# Altium schematic sheet pga_zif.SchDoc
size 482 x 304 mm; SheetNumber: 7; SheetTotal: 13
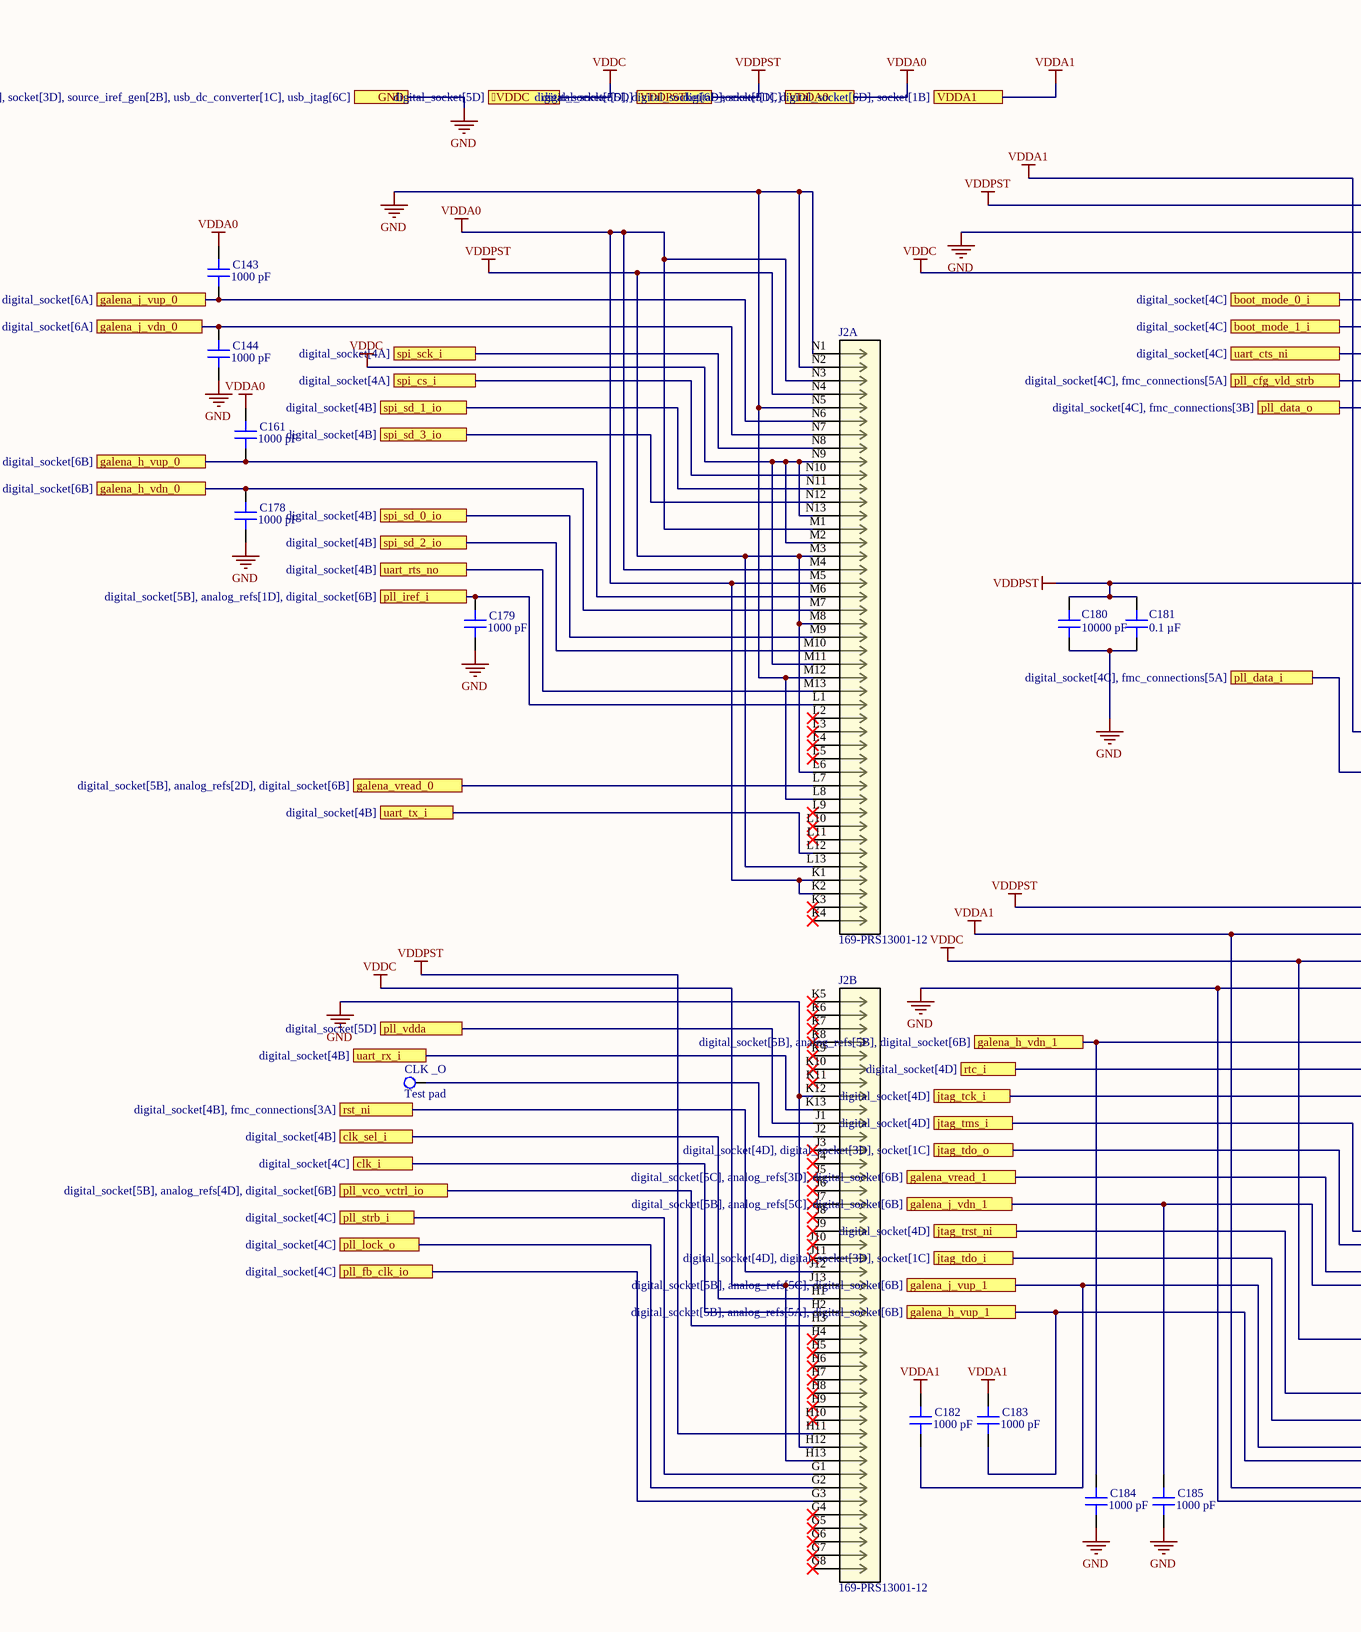
[diagram p0: pga_zif.SchDoc, left]
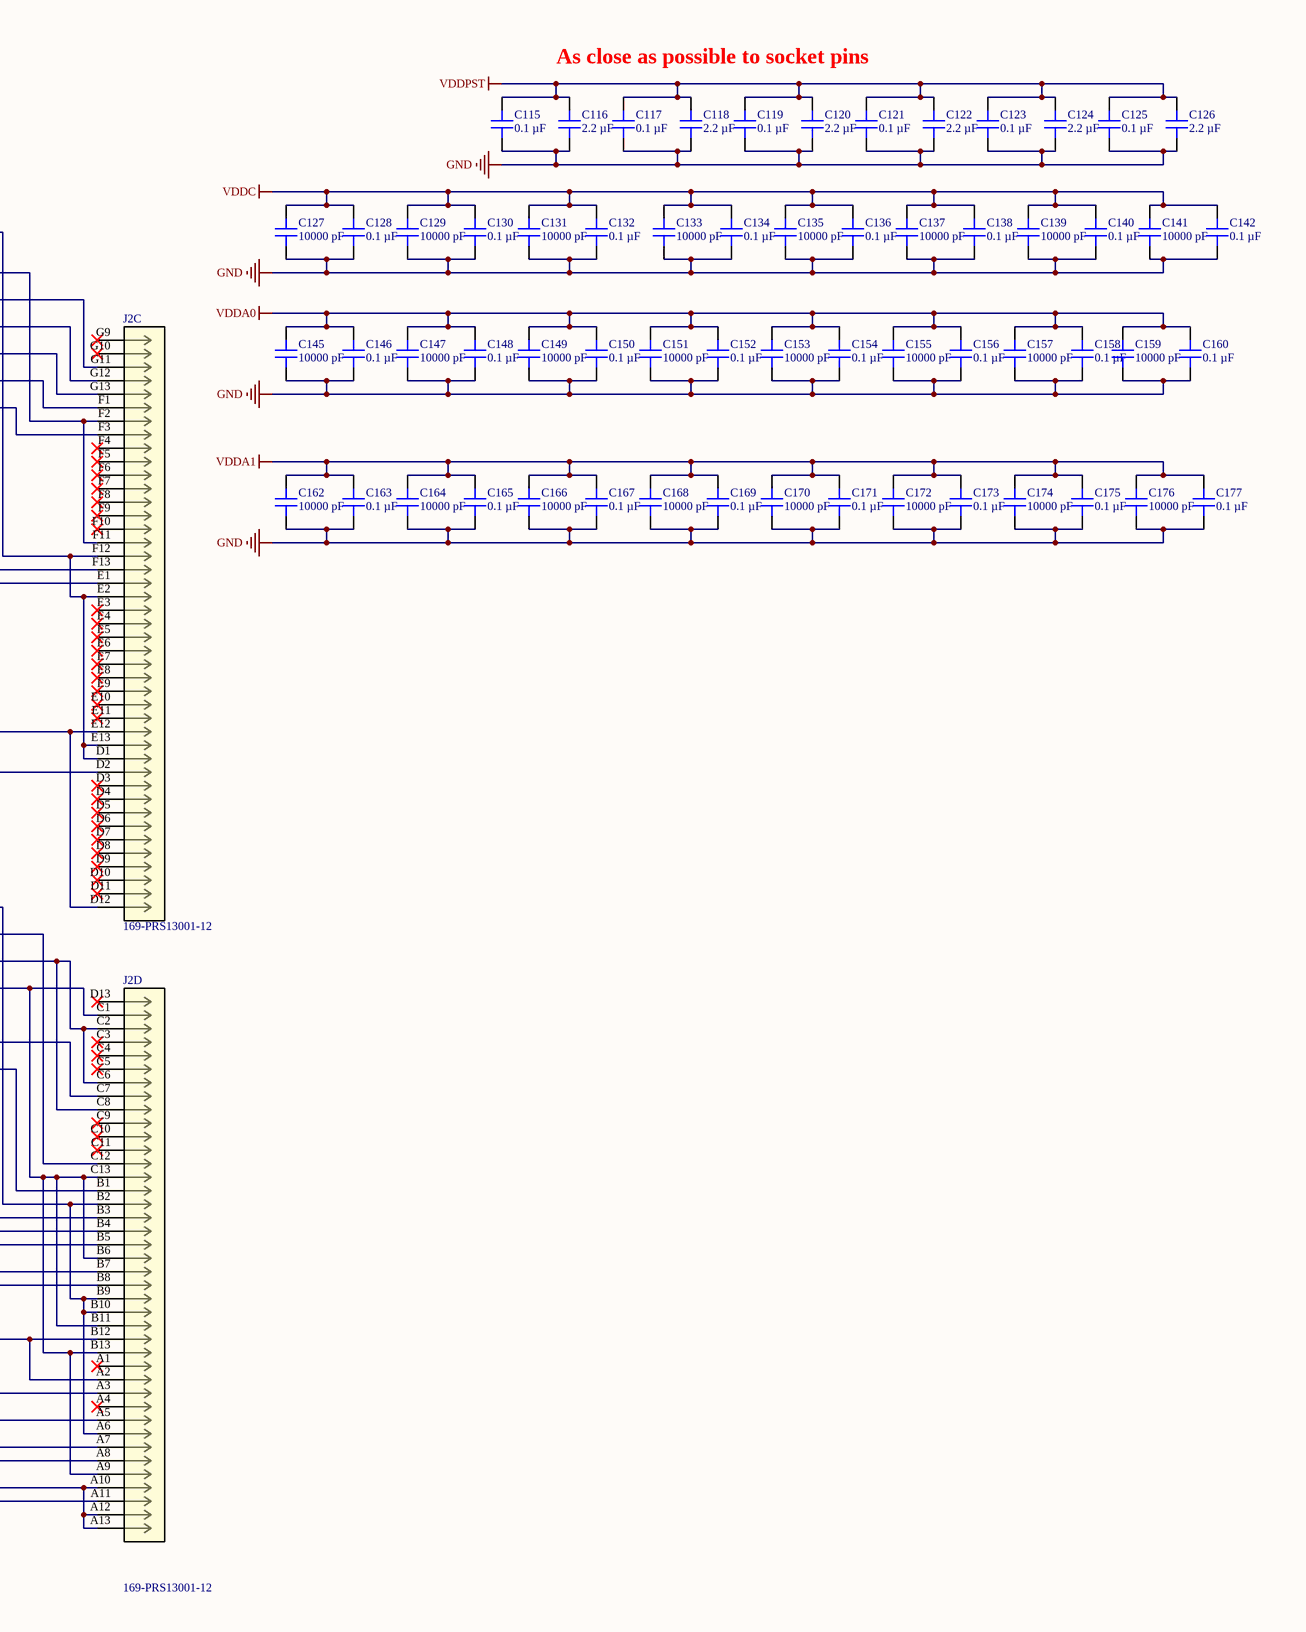
[diagram p1: pga_zif.SchDoc, right]

## Parts
C115  0.1 µF  [CAP 0805_2012]
C116  2.2 µF  [CAP 0805_2012]
C117  0.1 µF  [CAP 0805_2012]
C118  2.2 µF  [CAP 0805_2012]
C119  0.1 µF  [CAP 0805_2012]
C120  2.2 µF  [CAP 0805_2012]
C121  0.1 µF  [CAP 0805_2012]
C122  2.2 µF  [CAP 0805_2012]
C123  0.1 µF  [CAP 0805_2012]
C124  2.2 µF  [CAP 0805_2012]
C125  0.1 µF  [CAP 0805_2012]
C126  2.2 µF  [CAP 0805_2012]
C127  10000 pF  [CAP 0805_2012]
C128  0.1 µF  [CAP 0805_2012]
C129  10000 pF  [CAP 0805_2012]
C130  0.1 µF  [CAP 0805_2012]
C131  10000 pF  [CAP 0805_2012]
C132  0.1 µF  [CAP 0805_2012]
C133  10000 pF  [CAP 0805_2012]
C134  0.1 µF  [CAP 0805_2012]
C135  10000 pF  [CAP 0805_2012]
C136  0.1 µF  [CAP 0805_2012]
C137  10000 pF  [CAP 0805_2012]
C138  0.1 µF  [CAP 0805_2012]
C139  10000 pF  [CAP 0805_2012]
C140  0.1 µF  [CAP 0805_2012]
C141  10000 pF  [CAP 0805_2012]
C142  0.1 µF  [CAP 0805_2012]
C143  1000 pF  [CAP 0805_2012]
C144  1000 pF  [CAP 0805_2012]
C145  10000 pF  [CAP 0805_2012]
C146  0.1 µF  [CAP 0805_2012]
C147  10000 pF  [CAP 0805_2012]
C148  0.1 µF  [CAP 0805_2012]
C149  10000 pF  [CAP 0805_2012]
C150  0.1 µF  [CAP 0805_2012]
C151  10000 pF  [CAP 0805_2012]
C152  0.1 µF  [CAP 0805_2012]
C153  10000 pF  [CAP 0805_2012]
C154  0.1 µF  [CAP 0805_2012]
C155  10000 pF  [CAP 0805_2012]
C156  0.1 µF  [CAP 0805_2012]
C157  10000 pF  [CAP 0805_2012]
C158  0.1 µF  [CAP 0805_2012]
C159  10000 pF  [CAP 0805_2012]
C160  0.1 µF  [CAP 0805_2012]
C161  1000 pF  [CAP 0805_2012]
C162  10000 pF  [CAP 0805_2012]
C163  0.1 µF  [CAP 0805_2012]
C164  10000 pF  [CAP 0805_2012]
C165  0.1 µF  [CAP 0805_2012]
C166  10000 pF  [CAP 0805_2012]
C167  0.1 µF  [CAP 0805_2012]
C168  10000 pF  [CAP 0805_2012]
C169  0.1 µF  [CAP 0805_2012]
C170  10000 pF  [CAP 0805_2012]
C171  0.1 µF  [CAP 0805_2012]
C172  10000 pF  [CAP 0805_2012]
C173  0.1 µF  [CAP 0805_2012]
C174  10000 pF  [CAP 0805_2012]
C175  0.1 µF  [CAP 0805_2012]
C176  10000 pF  [CAP 0805_2012]
C177  0.1 µF  [CAP 0805_2012]
C178  1000 pF  [CAP 0805_2012]
C179  1000 pF  [CAP 0805_2012]
C180  10000 pF  [CAP 0805_2012]
C181  0.1 µF  [CAP 0805_2012]
C182  1000 pF  [CAP 0805_2012]
C183  1000 pF  [CAP 0805_2012]
C184  1000 pF  [CAP 0805_2012]
C185  1000 pF  [CAP 0805_2012]
CLK__O  Test pad  [Test Pad]
J2  169-PRS13001-12  [CONN_169-PRS13001-12_ARS]  (parts A,B,C,D of 4)

## Ports
VDDC (see digital_socket[5D]), boot_mode_0_i (see digital_socket[4C]), boot_mode_1_i (see digital_socket[4C]), clk_i (see digital_socket[4C]), clk_sel_i (see digital_socket[4B]), galena_h_vdn_0 (see digital_socket[5B], analog_refs[3C], digital_socket[6B]), galena_h_vdn_1 (see digital_socket[5B], analog_refs[5B], digital_socket[6B]), galena_h_vup_0 (see digital_socket[5B], analog_refs[3C], digital_socket[6B]), galena_h_vup_1 (see digital_socket[5B], analog_refs[5A], digital_socket[6B]), galena_j_vdn_0 (see digital_socket[5A], analog_refs[2C], digital_socket[6A]), galena_j_vdn_1 (see digital_socket[5B], analog_refs[5C], digital_socket[6B]), galena_j_vup_0 (see digital_socket[5A], analog_refs[2C], digital_socket[6A]), galena_j_vup_1 (see digital_socket[5B], analog_refs[5C], digital_socket[6B]), galena_vread_0 (see digital_socket[5B], analog_refs[2D], digital_socket[6B]), galena_vread_1 (see digital_socket[5C], analog_refs[3D], digital_socket[6B]), GND (see digital_socket[5D], analog_refs[3B], digital_socket[1A], fmc_connections[6A], pcb_clk[6A], select_load[5A], sink_iref_gen[1A], socket[3D], source_iref_gen[2B], usb_dc_converter[1C], usb_jtag[6C]), jtag_tck_i (see digital_socket[4D]), jtag_tdo_i (see digital_socket[4D], digital_socket[3D], socket[1C]), jtag_tdo_o (see digital_socket[4D], digital_socket[3D], socket[1C]), jtag_tms_i (see digital_socket[4D]), jtag_trst_ni (see digital_socket[4D]), pll_cfg_vld_strb (see digital_socket[4C], fmc_connections[5A]), pll_data_i (see digital_socket[4C], fmc_connections[5A]), pll_data_o (see digital_socket[4C], fmc_connections[3B]), pll_fb_clk_io (see digital_socket[4C]), pll_iref_i (see digital_socket[5B], analog_refs[1D], digital_socket[6B]), pll_lock_o (see digital_socket[4C]), pll_strb_i (see digital_socket[4C]), pll_vco_vctrl_io (see digital_socket[5B], analog_refs[4D], digital_socket[6B]), pll_vdda (see digital_socket[5D]), rst_ni (see digital_socket[4B], fmc_connections[3A]), rtc_i (see digital_socket[4D]), spi_cs_i (see digital_socket[4A]), spi_sck_i (see digital_socket[4A]), spi_sd_0_io (see digital_socket[4B]), spi_sd_1_io (see digital_socket[4B]), spi_sd_2_io (see digital_socket[4B]), spi_sd_3_io (see digital_socket[4B]), uart_cts_ni (see digital_socket[4C]), uart_rts_no (see digital_socket[4B]), uart_rx_i (see digital_socket[4B]), uart_tx_i (see digital_socket[4B]), VDDA0 (see digital_socket[5D], digital_socket[6D], socket[1C]), VDDA1 (see digital_socket[5D], digital_socket[6D], socket[1B]), VDDPST (see digital_socket[5D])

## Nets
GND: C115.1 C116.1 C117.1 C118.1 C119.1 C120.1 C121.1 C122.1 C123.1 C124.1 C125.1 C126.1 C127.1 C128.1 C129.1 C130.1 C131.1 C132.1 C133.1 C134.1 C135.1 C136.1 C137.1 C138.1 C139.1 C140.1 C141.1 C142.1 C144.1 C145.1 C146.1 C147.1 C148.1 C149.1 C150.1 C151.1 C152.1 C153.1 C154.1 C155.1 C156.1 C157.1 C158.1 C159.1 C160.1 C162.1 C163.1 C164.1 C165.1 C166.1 C167.1 C168.1 C169.1 C170.1 C171.1 C172.1 C173.1 C174.1 C175.1 C176.1 C177.1 C178.1 C179.1 C180.1 C181.1 C184.1 C185.1 J2.A9 J2.A11 J2.B6 J2.B11 J2.B13 J2.C1 J2.C13 J2.D1 J2.E2 J2.E13 J2.F12 J2.H12 J2.K12 J2.L8 J2.M12 J2.N1 J2.N2 J2.N5 ; port GND
VDDA0: C143.2 C145.2 C146.2 C147.2 C148.2 C149.2 C150.2 C151.2 C152.2 C153.2 C154.2 C155.2 C156.2 C157.2 C158.2 C159.2 C160.2 C161.2 J2.K1 J2.K2 J2.M1 J2.M4 J2.M5 J2.N3 ; port VDDA0
VDDA1: C162.2 C163.2 C164.2 C165.2 C166.2 C167.2 C168.2 C169.2 C170.2 C171.2 C172.2 C173.2 C174.2 C175.2 C176.2 C177.2 C182.2 C183.2 J2.A10 J2.A12 J2.A13 J2.C12 J2.D12 J2.E12 ; port VDDA1
VDDC: C127.2 C128.2 C129.2 C130.2 C131.2 C132.2 C133.2 C134.2 C135.2 C136.2 C137.2 C138.2 C139.2 C140.2 C141.2 C142.2 J2.A2 J2.B12 J2.C2 J2.C6 J2.C8 J2.F2 J2.F11 J2.H13 J2.J13 J2.M2 J2.M11 J2.N9 J2.N13 ; port VDDC
VDDPST: C115.2 C116.2 C117.2 C118.2 C119.2 C120.2 C121.2 C122.2 C123.2 C124.2 C125.2 C126.2 C180.2 C181.2 J2.A6 J2.B2 J2.B9 J2.B10 J2.E1 J2.F13 J2.H11 J2.L6 J2.L13 J2.M3 J2.M8 J2.N4 ; port VDDPST
boot_mode_0_i: J2.G11 ; port boot_mode_0_i
boot_mode_1_i: J2.G12 ; port boot_mode_1_i
clk_i: J2.H2 ; port clk_i
clk_sel_i: J2.H1 ; port clk_sel_i
galena_h_vdn_0: C178.2 J2.M7 ; port galena_h_vdn_0
galena_h_vdn_1: C184.2 J2.C7 ; port galena_h_vdn_1
galena_h_vup_0: C161.1 J2.M6 ; port galena_h_vup_0
galena_h_vup_1: C183.1 J2.A8 ; port galena_h_vup_1
galena_j_vdn_0: C144.2 J2.N7 ; port galena_j_vdn_0
galena_j_vdn_1: C185.2 J2.B8 ; port galena_j_vdn_1
galena_j_vup_0: C143.1 J2.N6 ; port galena_j_vup_0
galena_j_vup_1: C182.1 J2.A7 ; port galena_j_vup_1
galena_vread_0: J2.L7 ; port galena_vread_0
galena_vread_1: J2.B7 ; port galena_vread_1
jtag_tck_i: J2.B3 ; port jtag_tck_i
jtag_tdo_i: J2.A5 ; port jtag_tdo_i
jtag_tdo_o: J2.B5 ; port jtag_tdo_o
jtag_tms_i: J2.B4 ; port jtag_tms_i
jtag_trst_ni: J2.A3 ; port jtag_trst_ni
pll_cfg_vld_strb: J2.F1 ; port pll_cfg_vld_strb
pll_data_i: J2.D2 ; port pll_data_i
pll_data_o: J2.F3 ; port pll_data_o
pll_fb_clk_io: J2.G3 ; port pll_fb_clk_io
pll_iref_i: C179.2 J2.L1 ; port pll_iref_i
pll_lock_o: J2.G2 ; port pll_lock_o
pll_strb_i: J2.G1 ; port pll_strb_i
pll_vco_vctrl_io: J2.H3 ; port pll_vco_vctrl_io
pll_vdda: J2.J1 ; port pll_vdda
rst_ni: J2.J12 ; port rst_ni
rtc_i: J2.B1 ; port rtc_i
spi_cs_i: J2.N10 ; port spi_cs_i
spi_sck_i: J2.N8 ; port spi_sck_i
spi_sd_0_io: J2.M9 ; port spi_sd_0_io
spi_sd_1_io: J2.N11 ; port spi_sd_1_io
spi_sd_2_io: J2.M10 ; port spi_sd_2_io
spi_sd_3_io: J2.N12 ; port spi_sd_3_io
uart_cts_ni: J2.G13 ; port uart_cts_ni
uart_rts_no: J2.M13 ; port uart_rts_no
uart_rx_i: J2.K13 ; port uart_rx_i
uart_tx_i: J2.L12 ; port uart_tx_i
NetCLK__O_1: CLK__O.1 J2.J2

Not connected (* = marked no-connect by the designer): J2 A1* A4* C3* C4* C5* C9* C10* C11* D3* D4* D5* D6* D7* D8* D9* D10* D11* D13* E3* E4* E5* E6* E7* E8* E9* E10* E11* F4* F5* F6* F7* F8* F9* F10* G4* G5* G6* G7* G8* G9* G10* H4* H5* H6* H7* H8* H9* H10* J3* J4* J5* J6* J7* J8* J9* J10* J11* K3* K4* K5* K6* K7* K8* K9* K10* K11* L2* L3* L4* L5* L9* L10* L11*

## Notes on the sheet
- As close as possible to socket pins

## Library data of the parts
C115 C117 C119 C121 C123 C125 C128 C130 C132 C134 C136 C138 C140 C142 C146 C148 C150 C152 C154 C156 C158 C160 C163 C165 C167 C169 C171 C173 C175 C177 C181 = C0805X104K8RAC7800: .100UF 10.0V; manufacturer: KEMET; Temperature Coefficient: X7R; Tolerance: ±10%; Voltage - Rated: 10V; Part Number: C0805X104K8RAC7800; Capacitance: 0.1 µF; Applications: Boardflex Sensitive; componentlink1description: Datasheet; componentlink1url: https://connect.kemet.com:7667/gateway/IntelliData-ComponentDocumentation/1.0/download/datasheet/C0805X104K8RAC7800; componentlink2description: DigiKey Link; componentlink2url: https://www.digikey.com/en/products/detail/kemet/C0805X104K8RAC7800/12083302; Device Package: 0805 (2012 Metric); Features: Soft Termination; lastupdated: 4/6/2026 7:31:44 PM; Lifecycle Status: Active; Minimum Order: 1; Mounting Type: Surface Mount, MLCC; Operating Temperature: -55°C ~ 125°C; Package / Case: 0805 (2012 Metric); packaging: TapeAndReel; partid: 46188; Part Status: Active; price: 0.11; series: SMD Comm X7R Flex; Size / Dimension: 0.079" L x 0.049" W (2.00mm x 1.25mm); Supplier 1: DigiKey; Supplier Part Number 1: 399-C0805X104K8RAC7800CT-ND; Thickness (Max): 0.039" (0.98mm); value: 0.1 µF
C116 C118 C120 C122 C124 C126 = GMC21X7R225K10NT: CAP0805 X7R 2.2UF 10% 10V; manufacturer: Cal-Chip Electronics, Inc.; Part Number: GMC21X7R225K10NT; Capacitance: 2.2 µF; Applications: General Purpose; componentlink2description: DigiKey Link; componentlink2url: https://www.digikey.com/en/products/detail/cal-chip-electronics-inc/GMC21X7R225K10NT/22099349; Device Package: 0805 (2012 Metric); lastupdated: 4/6/2026 7:29:32 PM; Lifecycle Status: Active; Minimum Order: 1; Mounting Type: Surface Mount, MLCC; Operating Temperature: -55°C ~ 125°C; Package / Case: 0805 (2012 Metric); packaging: TapeAndReel; partid: 73352; price: 0.02; series: GMC; Size / Dimension: 0.079" L x 0.049" W (2.00mm x 1.25mm); Supplier 1: DigiKey; Supplier Part Number 1: 4713-GMC21X7R225K10NTCT-ND; Temperature Coefficient: X7R; Thickness (Max): 0.057" (1.45mm); Tolerance: ±10%; value: 2.2 µF; Voltage - Rated: 10V
C127 C129 C131 C133 C135 C137 C139 C141 C145 C147 C149 C151 C153 C155 C157 C159 C162 C164 C166 C168 C170 C172 C174 C176 C180 = C0805Y103K4RACTU: .010UF 16.0V; manufacturer: KEMET; Temperature Coefficient: X7R; Tolerance: ±10%; Voltage - Rated: 16V; Part Number: C0805Y103K4RACTU; Capacitance: 10000 pF; Applications: Boardflex Sensitive; componentlink1description: Datasheet; componentlink1url: https://search.kemet.com/download/datasheet/C0805Y103K4RAC7800; componentlink2description: DigiKey Link; componentlink2url: https://www.digikey.com/en/products/detail/kemet/C0805Y103K4RACTU/12083238; Device Package: 0805 (2012 Metric); Features: Floating Electrode, Soft Termination; lastupdated: 4/6/2026 7:28:53 PM; Lifecycle Status: Active; Minimum Order: 1; Mounting Type: Surface Mount, MLCC; Operating Temperature: -55°C ~ 125°C; Package / Case: 0805 (2012 Metric); packaging: TapeAndReel; partid: 70534; price: 0.07; series: SMD Comm X7R FF; Size / Dimension: 0.079" L x 0.049" W (2.00mm x 1.25mm); Supplier 1: DigiKey; Supplier Part Number 1: 399-C0805Y103K4RACTUCT-ND; Thickness (Max): 0.039" (0.98mm); value: 10000 pF
C143 C144 C161 C178 C179 C182-C185 = C0805C102F3HACAUTO: CAP CER 0805 1NF 25V ULTRA STABL; manufacturer: KEMET; Temperature Coefficient: X8R; Tolerance: ±1%; Part Number: C0805C102F3HACAUTO; Capacitance: 1000 pF; Applications: Automotive; componentlink1description: Datasheet; componentlink1url: https://api.kemet.com/component-edge/download/datasheet/C0805C102F3HACAUTO.pdf; componentlink2description: DigiKey Link; componentlink2url: https://www.digikey.com/en/products/detail/kemet/C0805C102F3HACAUTO/7958218; Device Package: 0805 (2012 Metric); Features: Low ESL, High Temperature; lastupdated: 4/6/2026 7:32:03 PM; Lifecycle Status: Active; Minimum Order: 1; Mounting Type: Surface Mount, MLCC; Operating Temperature: -55°C ~ 150°C; Package / Case: 0805 (2012 Metric); packaging: TapeAndReel; partid: 32894; Part Status: Active; price: 0.05; Ratings: AEC-Q200; series: SMD Auto X8R HT150C; Size / Dimension: 0.079" L x 0.049" W (2.00mm x 1.25mm); Supplier 1: DigiKey; Supplier Part Number 1: 399-C0805C102F3HACAUTOCT-ND; Thickness (Max): 0.035" (0.88mm); value: 1000 pF; Voltage - Rated: 25V
J2 = 169-PRS13001-12: Description; Manufacturer_Name: Aries; Copyright: Copyright (C) 2026 Ultra Librarian. All rights reserved.; Manufacturer_Part_Number: 169-PRS13001-12; RefDes: RefDes; Type: Type